# EAGLE schematic fire-alarm-schema-electrica (EAGLE 9.6.2)
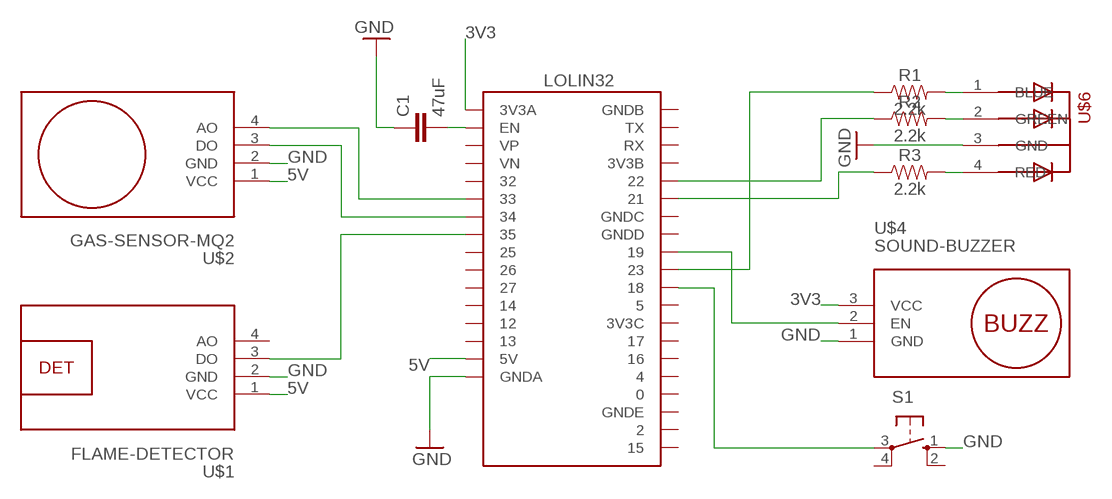
[diagram p0: schematic, sheet 1]

## Parts
C1  47uF  10UF-0603-6.3V-20%  [0603]
LOLIN32  SSFD_LOLIN32_WEMOS_CHINA_W_BATT  [SSFD_LOLIN32_WEMOS_CHINA_W_BATT]
R1  2.2k  2.2KOHM-0603-1/10W-1%  [0603]
R2  2.2k  2.2KOHM-0603-1/10W-1%  [0603]
R3  2.2k  2.2KOHM-0603-1/10W-1%  [0603]
S1  10-XX  [B3F-10XX]
U$1  FLAME-DETECTOR  [FLAME-DETECTOR]
U$2  GAS-SENSOR-MQ2  [GAS-SENSOR-MQ2]
U$4  SOUND-BUZZER  [SOUND-BUZZER]
U$6  5MMRGBLED  [LED5MMRGB]

## Nets
3V3: LOLIN32.3V3A U$4.3(VCC)
5V: LOLIN32.5V U$1.1(VCC) U$2.1(VCC)
GND: C1.1 LOLIN32.GNDA S1.1(S) U$1.2(GND) U$2.2(GND) U$4.1(GND) U$6.3(GND)
N$1: LOLIN32.21 R3.1
N$2: LOLIN32.22 R2.1
N$3: LOLIN32.33 U$2.4(AO)
N$4: LOLIN32.34 U$2.3(DO)
N$5: LOLIN32.23 R1.1
N$6: R1.2 U$6.1(BLUE)
N$7: R2.2 U$6.2(GREEN)
N$8: LOLIN32.19 U$4.2(EN)
N$9: LOLIN32.18 S1.3(P)
N$10: C1.2 LOLIN32.EN
N$11: LOLIN32.35 U$1.3(DO)
N$18: R3.2 U$6.4(RED)
Unconnected: LOLIN32.0 LOLIN32.2 LOLIN32.3V3B LOLIN32.3V3C LOLIN32.4 LOLIN32.5 LOLIN32.12 LOLIN32.13 LOLIN32.14 LOLIN32.15 LOLIN32.16 LOLIN32.17 LOLIN32.25 LOLIN32.26 LOLIN32.27 LOLIN32.32 LOLIN32.GNDB LOLIN32.GNDC LOLIN32.GNDD LOLIN32.GNDE LOLIN32.RX LOLIN32.TX LOLIN32.VN LOLIN32.VP S1.2(S1) S1.4(P1) U$1.4(AO)

## Library data of the parts
C1 = SparkFun-Capacitors:10UF: 10.0µF ceramic capacitors A capacitor is a passive two-terminal electrical component used to store electrical energy temporarily in an electric field.; PROD_ID: CAP-11015; VALUE: 10uF
LOLIN32 = SSFD - ESP32 WEMOS LOLIN CHINA W_BATT:SSFD_LOLIN32_WEMOS_CHINA_W_BATT: BY SEGASONICFAN DESIGNS HTTP://WWW.SEGASONICFAN.WIXSITE.COM/RETRO WEMOS ESP32 BREAKOUT 4MB CHINA WITH BATTERY CONNECTOR https://arduino-projekte.info/wemos-lolin32/ https://diyprojects.io/wemos-lolin32-new-development-board-esp32-e645-4mb-memory-lipo-battery-connector/
R1-R3 = SparkFun-Resistors:2.2KOHM: 2.2kΩ resistor A resistor is a passive two-terminal electrical component that implements electrical resistance as a circuit element. Resistors act to reduce current flow, and, at the same time, act to lower voltage levels within circuits. - Wikipedia; PROD_ID: RES-08272
S1 = switch-omron:10-XX: OMRON SWITCH; MPN: B3F-1000; OC_FARNELL: 176432; OC_NEWARK: 36M3542
U$1 = diy-modules:FLAME-DETECTOR: Flame Detector Click here to find device on ebay.com <http://www.ebay.com/sch/flame+detector+arduino>
U$2 = diy-modules:GAS-SENSOR-MQ2: Gas Sensor based on MQ-2 device Guide describing how to use MQ-2 sensor with Arduino is available here: http://www.instructables.com/id/How-to-use-MQ2-Gas-Sensor-Arduino-Tutorial/ MQ-2 sensor datasheet is available here: http://gas-sensor.ru/pdf/combustible-gas-sensor.pdf Click here to find device on ebay.com <http://www.ebay.com/sch/mq2+sensor+module+smoke>
U$4 = diy-modules:SOUND-BUZZER: Sound Buzzer Module Click here to find device on ebay.com <http://www.ebay.com/sch/passive+buzzer+beep+module>
U$6 = adafruit:5MMRGBLED